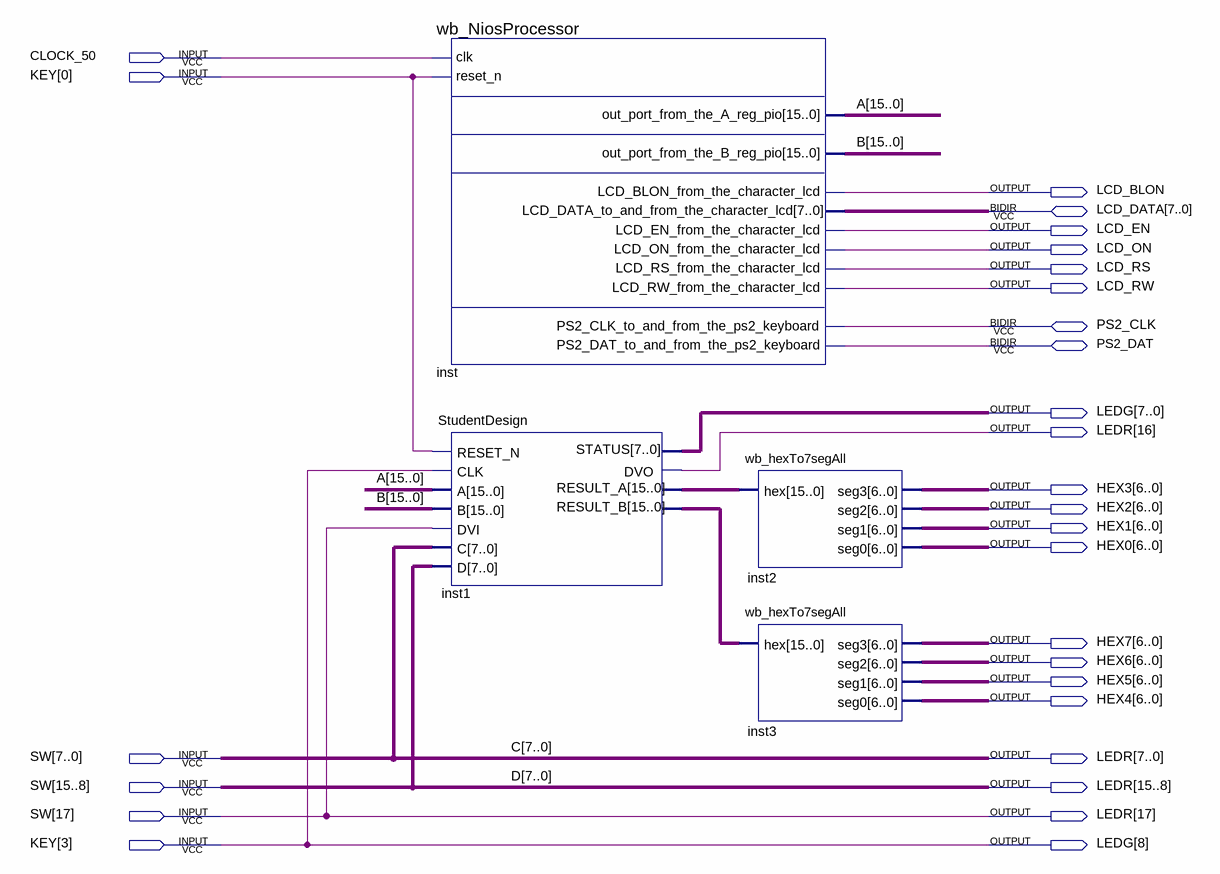
[diagram p0: schematic sheet]
// Quartus schematic Lab2.bdf as structural Verilog: 4 symbols, 28 pins
module Lab2 (
  input  CLOCK_50,
  input  [3:0] KEY,
  input  [17:0] SW,
  inout  [7:0] LCD_DATA,
  inout  PS2_CLK,
  inout  PS2_DAT,
  output LCD_BLON,
  output LCD_EN,
  output LCD_ON,
  output LCD_RS,
  output LCD_RW,
  output [8:0] LEDG,
  output [17:0] LEDR,
  output [6:0] HEX3,
  output [6:0] HEX2,
  output [6:0] HEX1,
  output [6:0] HEX0,
  output [6:0] HEX7,
  output [6:0] HEX6,
  output [6:0] HEX5,
  output [6:0] HEX4
);

  wire [15:0] A, B, inst1_result_a, inst1_result_b;

  wb_NiosProcessor inst (
    .clk(CLOCK_50), .reset_n(KEY[0]), .out_port_from_the_A_reg_pio(A), .out_port_from_the_B_reg_pio(B),
    .LCD_BLON_from_the_character_lcd(LCD_BLON), .LCD_EN_from_the_character_lcd(LCD_EN),
    .LCD_ON_from_the_character_lcd(LCD_ON), .LCD_RS_from_the_character_lcd(LCD_RS),
    .LCD_RW_from_the_character_lcd(LCD_RW), .LCD_DATA_to_and_from_the_character_lcd(LCD_DATA),
    .PS2_CLK_to_and_from_the_ps2_keyboard(PS2_CLK), .PS2_DAT_to_and_from_the_ps2_keyboard(PS2_DAT));
  StudentDesign inst1 (
    .A(A), .B(B), .C(SW[7:0]), .DVI(SW[17]), .D(SW[15:8]), .CLK(KEY[3]), .RESET_N(KEY[0]),
    .RESULT_A(inst1_result_a), .RESULT_B(inst1_result_b), .STATUS(LEDG[7:0]), .DVO(LEDR[16]));
  wb_hexTo7segAll inst2 (.hex(inst1_result_a), .seg3(HEX3), .seg2(HEX2), .seg1(HEX1), .seg0(HEX0));
  wb_hexTo7segAll inst3 (.hex(inst1_result_b), .seg3(HEX7), .seg2(HEX6), .seg1(HEX5), .seg0(HEX4));

  assign LEDG[8] = KEY[3];
  assign {LEDR[17], LEDR[15:0]} = {SW[17], SW[15:0]};

  // Other names for the same wires on the sheet: C[7:0] = SW[7:0]; D[7:0] = SW[15:8]
endmodule
